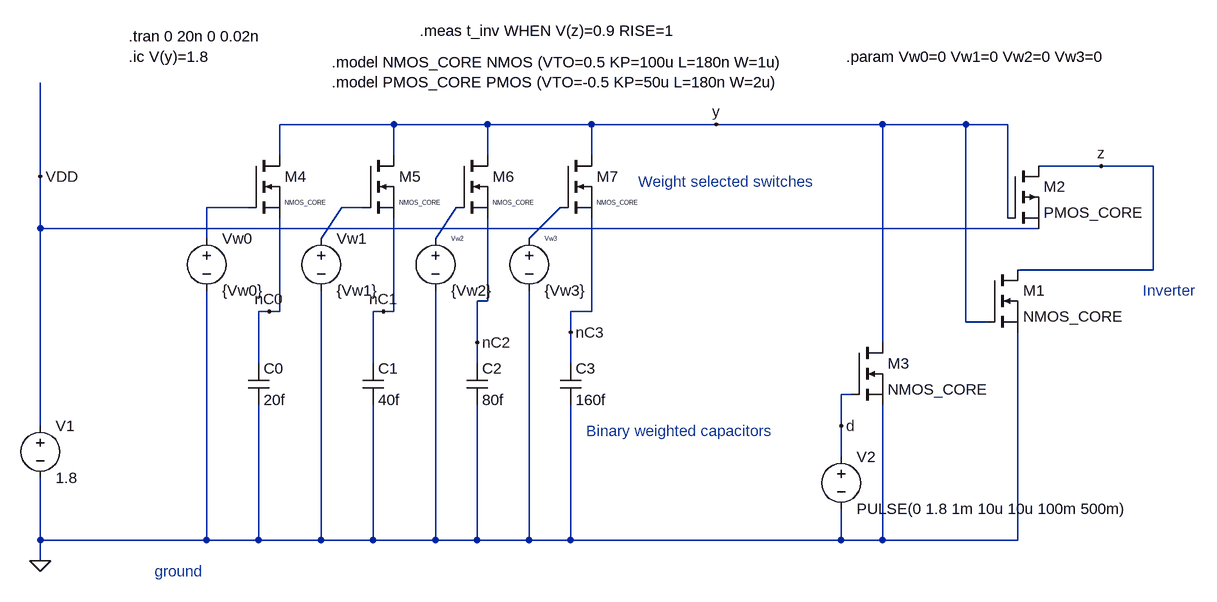
[diagram p0: schematic Single Cell Attempt 2.asc]
Single Cell Attempt 2.asc, the LTspice schematic file:
Version 4.1
SHEET 1 2464 1060
WIRE 576 64 400 64
WIRE 720 64 576 64
WIRE 880 64 720 64
WIRE 1072 64 880 64
WIRE 1328 64 1072 64
WIRE 1456 64 1328 64
WIRE 1520 64 1456 64
WIRE 400 112 400 64
WIRE 576 112 576 64
WIRE 720 112 720 64
WIRE 880 112 880 64
WIRE 1664 128 1568 128
WIRE 1744 128 1664 128
WIRE 32 144 32 0
WIRE 352 192 288 192
WIRE 528 192 496 192
WIRE 1520 208 1520 64
WIRE 32 224 32 144
WIRE 1568 224 32 224
WIRE 288 240 288 192
WIRE 464 240 496 192
WIRE 640 240 672 192
WIRE 784 240 832 192
WIRE 1744 288 1744 128
WIRE 1744 288 1536 288
WIRE 720 336 720 208
WIRE 720 336 704 336
WIRE 384 352 368 352
WIRE 400 352 400 208
WIRE 400 352 384 352
WIRE 560 352 544 352
WIRE 576 352 576 208
WIRE 576 352 560 352
WIRE 880 352 880 208
WIRE 880 352 848 352
WIRE 1456 368 1456 64
WIRE 1488 368 1456 368
WIRE 848 384 848 352
WIRE 704 400 704 336
WIRE 1328 400 1328 64
WIRE 368 432 368 352
WIRE 544 432 544 352
WIRE 704 432 704 400
WIRE 848 432 848 384
WIRE 1280 480 1264 480
WIRE 32 528 32 224
WIRE 1264 528 1264 480
WIRE 1264 576 1264 528
WIRE 32 704 32 608
WIRE 288 704 288 320
WIRE 288 704 32 704
WIRE 368 704 368 496
WIRE 368 704 288 704
WIRE 464 704 464 320
WIRE 464 704 368 704
WIRE 544 704 544 496
WIRE 544 704 464 704
WIRE 640 704 640 320
WIRE 640 704 544 704
WIRE 704 704 704 496
WIRE 704 704 640 704
WIRE 784 704 784 320
WIRE 784 704 704 704
WIRE 848 704 848 496
WIRE 848 704 784 704
WIRE 1264 704 1264 656
WIRE 1264 704 848 704
WIRE 1328 704 1328 496
WIRE 1328 704 1264 704
WIRE 1536 704 1536 384
WIRE 1536 704 1328 704
WIRE 32 736 32 704
FLAG 32 144 VDD
FLAG 32 736 0
FLAG 1664 128 z
FLAG 1264 528 d
FLAG 1072 64 y
FLAG 384 352 nC0
FLAG 560 352 nC1
FLAG 704 400 nC2
FLAG 848 384 nC3
SYMBOL voltage 32 512 R0
WINDOW 123 0 0 Left 0
WINDOW 39 0 0 Left 0
SYMATTR InstName V1
SYMATTR Value 1.8
SYMBOL nmos 1488 288 R0
SYMATTR InstName M1
SYMATTR Value NMOS_CORE
SYMBOL pmos 1520 128 R0
SYMATTR InstName M2
SYMATTR Value PMOS_CORE
SYMBOL nmos 1280 400 R0
SYMATTR InstName M3
SYMATTR Value NMOS_CORE
SYMBOL voltage 1264 560 R0
WINDOW 123 0 0 Left 0
WINDOW 39 0 0 Left 0
SYMATTR InstName V2
SYMATTR Value PULSE(0 1.8 1m 10u 10u 100m 500m)
SYMBOL nmos 528 112 R0
WINDOW 3 56 72 Left 0
SYMATTR Value NMOS_CORE
SYMATTR InstName M5
SYMBOL nmos 672 112 R0
WINDOW 3 56 72 Left 0
SYMATTR Value NMOS_CORE
SYMATTR InstName M6
SYMBOL nmos 832 112 R0
WINDOW 3 56 72 Left 0
SYMATTR Value NMOS_CORE
SYMATTR InstName M7
SYMBOL nmos 352 112 R0
WINDOW 3 56 72 Left 0
SYMATTR Value NMOS_CORE
SYMATTR InstName M4
SYMBOL cap 528 432 R0
SYMATTR InstName C1
SYMATTR Value 40f
SYMBOL cap 688 432 R0
SYMATTR InstName C2
SYMATTR Value 80f
SYMBOL cap 832 432 R0
SYMATTR InstName C3
SYMATTR Value 160f
SYMBOL cap 352 432 R0
SYMATTR InstName C0
SYMATTR Value 20f
SYMBOL voltage 288 224 R0
WINDOW 123 0 0 Left 0
WINDOW 39 0 0 Left 0
SYMATTR InstName Vw0
SYMATTR Value {Vw0}
SYMBOL voltage 464 224 R0
WINDOW 123 0 0 Left 0
WINDOW 39 0 0 Left 0
SYMATTR InstName Vw1
SYMATTR Value {Vw1}
SYMBOL voltage 640 224 R0
WINDOW 0 24 16 Left 0
WINDOW 123 0 0 Left 0
WINDOW 39 0 0 Left 0
SYMATTR InstName Vw2
SYMATTR Value {Vw2}
SYMBOL voltage 784 224 R0
WINDOW 0 24 16 Left 0
WINDOW 123 0 0 Left 0
WINDOW 39 0 0 Left 0
SYMATTR InstName Vw3
SYMATTR Value {Vw3}
TEXT 208 752 Left 2 ;ground
TEXT 168 -72 Left 2 !.tran 0 20n 0 0.02n
TEXT 480 -32 Left 2 !.model NMOS_CORE NMOS (VTO=0.5 KP=100u L=180n W=1u)\n.model PMOS_CORE PMOS (VTO=-0.5 KP=50u L=180n W=2u)
TEXT 616 -80 Left 2 !.meas t_inv WHEN V(z)=0.9 RISE=1
TEXT 1728 320 Left 2 ;Inverter
TEXT 952 152 Left 2 ;Weight selected switches
TEXT 872 536 Left 2 ;Binary weighted capacitors
TEXT 168 -40 Left 2 !.ic V(y)=1.8
TEXT 1272 -40 Left 2 !.param Vw0=0 Vw1=0 Vw2=0 Vw3=0

The netlist it stands for:
* Single Cell Attempt 2.asc
V1 VDD 0 1.8
M1 z y 0 0 NMOS_CORE
M2 z y VDD VDD PMOS_CORE
M3 y d 0 0 NMOS_CORE
V2 d 0 PULSE(0 1.8 1m 10u 10u 100m 500m)
M5 y N002 nC1 nC1 NMOS_CORE
M6 y N003 nC2 nC2 NMOS_CORE
M7 y N004 nC3 nC3 NMOS_CORE
M4 y N001 nC0 nC0 NMOS_CORE
C1 nC1 0 40f
C2 nC2 0 80f
C3 nC3 0 160f
C0 nC0 0 20f
Vw0 N001 0 {Vw0}
Vw1 N002 0 {Vw1}
Vw2 N003 0 {Vw2}
Vw3 N004 0 {Vw3}
.model NMOS NMOS
.model PMOS PMOS
.lib standard.mos
* ground
.tran 0 20n 0 0.02n
.model NMOS_CORE NMOS (VTO=0.5 KP=100u L=180n W=1u)
.model PMOS_CORE PMOS (VTO=-0.5 KP=50u L=180n W=2u)
.meas t_inv WHEN V(z)=0.9 RISE=1
* Inverter
* Weight selected switches
* Binary weighted capacitors
.ic V(y)=1.8
.param Vw0=0 Vw1=0 Vw2=0 Vw3=0
.backanno
.end

* Results of the author's LTspice run, read from the files saved beside the schematic
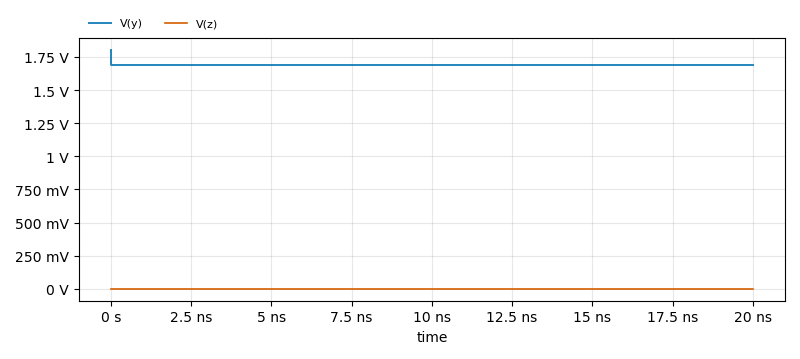
[diagram p1: Transient Analysis of Single Cell Attempt 2.asc, plotted from the saved traces]
* Transient Analysis, 1 run:
*   V(y): min 1.692 V, max 1.8 V, average 1.692 V, rms 1.692 V, last 1.692 V
*   V(z): min 4.998 nV, max 5.451 nV, average 5.45 nV, rms 5.45 nV, last 5.45 nV
* From the log:
*   Measurement "t_inv" FAIL'ed